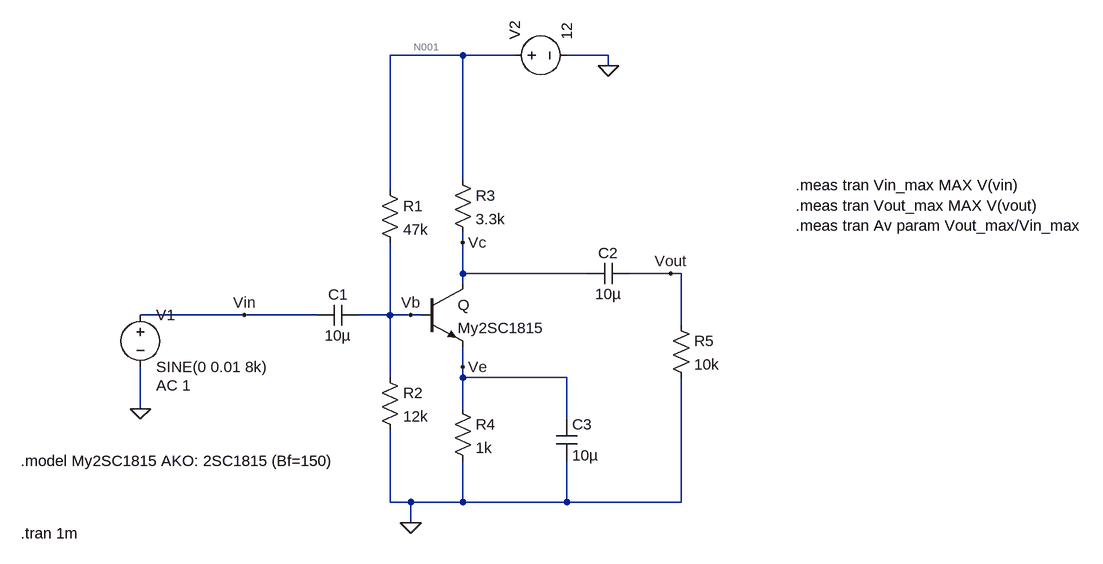
[diagram p0: schematic AC.asc]
AC.asc, the LTspice schematic file:
Version 4.1
SHEET 1 1140 696
WIRE 144 -208 32 -208
WIRE 224 -208 144 -208
WIRE 368 -208 304 -208
WIRE 368 -192 368 -208
WIRE 144 -16 144 -208
WIRE 32 0 32 -208
WIRE 144 80 144 64
WIRE 144 128 144 80
WIRE 336 128 144 128
WIRE 464 128 400 128
WIRE 480 128 464 128
WIRE 144 144 144 128
WIRE -192 192 -352 192
WIRE -80 192 -192 192
WIRE 32 192 32 80
WIRE 32 192 -16 192
WIRE 64 192 32 192
WIRE 80 192 64 192
WIRE 480 208 480 128
WIRE 144 272 144 240
WIRE 32 288 32 192
WIRE 144 288 144 272
WIRE 304 288 144 288
WIRE -352 336 -352 272
WIRE 144 336 144 288
WIRE 304 352 304 288
WIRE 32 480 32 368
WIRE 64 480 32 480
WIRE 144 480 144 416
WIRE 144 480 64 480
WIRE 304 480 304 416
WIRE 304 480 144 480
WIRE 480 480 480 288
WIRE 480 480 304 480
WIRE 64 512 64 480
FLAG 64 512 0
FLAG 368 -192 0
FLAG -352 336 0
FLAG 64 192 Vb
FLAG 144 272 Ve
FLAG 144 80 Vc
FLAG 464 128 Vout
FLAG -192 192 Vin
SYMBOL npn 80 144 R0
SYMATTR InstName Q
SYMATTR Value My2SC1815
SYMBOL voltage -352 176 R0
WINDOW 123 24 124 Left 2
WINDOW 39 0 0 Left 0
SYMATTR Value2 AC 1
SYMATTR InstName V1
SYMATTR Value SINE(0 0.01 8k)
SYMBOL cap -16 176 R90
WINDOW 0 0 32 VBottom 2
WINDOW 3 32 32 VTop 2
SYMATTR InstName C1
SYMATTR Value 10µ
SYMBOL res 16 -16 R0
SYMATTR InstName R1
SYMATTR Value 47k
SYMBOL res 128 -32 R0
SYMATTR InstName R3
SYMATTR Value 3.3k
SYMBOL voltage 208 -208 R270
WINDOW 123 0 0 Left 0
WINDOW 39 0 0 Left 0
SYMATTR InstName V2
SYMATTR Value 12
SYMBOL cap 400 112 R90
WINDOW 0 0 32 VBottom 2
WINDOW 3 32 32 VTop 2
SYMATTR InstName C2
SYMATTR Value 10µ
SYMBOL res 464 192 R0
SYMATTR InstName R5
SYMATTR Value 10k
SYMBOL res 128 320 R0
SYMATTR InstName R4
SYMATTR Value 1k
SYMBOL cap 288 352 R0
SYMATTR InstName C3
SYMATTR Value 10µ
SYMBOL res 16 272 R0
SYMATTR InstName R2
SYMATTR Value 12k
TEXT -536 416 Left 2 !.model My2SC1815 AKO: 2SC1815 (Bf=150)
TEXT -536 528 Left 2 !.tran 1m
TEXT 656 -8 Left 2 !.meas tran Vin_max MAX V(vin)\n.meas tran Vout_max MAX V(vout)\n.meas tran Av param Vout_max/Vin_max

The netlist it stands for:
* AC.asc
Q Vc Vb Ve 0 My2SC1815
V1 Vin 0 SINE(0 0.01 8k) AC 1
C1 Vb Vin 10µ
R1 N001 Vb 47k
R3 N001 Vc 3.3k
V2 N001 0 12
C2 Vout Vc 10µ
R5 Vout 0 10k
R4 Ve 0 1k
C3 Ve 0 10µ
R2 Vb 0 12k
.model NPN NPN
.model PNP PNP
.lib standard.bjt
.model My2SC1815 AKO: 2SC1815 (Bf=150)
.tran 1m
.meas tran Vin_max MAX V(vin)
.meas tran Vout_max MAX V(vout)
.meas tran Av param Vout_max/Vin_max
.backanno
.end

* Results of the author's LTspice run, read from the files saved beside the schematic
* Operating Point, zero values left out:
*   V(vb) = 2.374 V
*   V(n001) = 12 V
*   V(vc) = 6.488 V
*   V(ve) = 1.677 V
*   I(R3) = 1.67 mA
*   I(R2) = 197.9 µA
*   Ic(Q) = 1.67 mA
*   Ib(Q) = 6.934 µA
*   Ie(Q) = -1.677 mA
*   I(V2) = -1.875 mA
*   I(R4) = 1.677 mA
*   I(R1) = 204.8 µA